# EAGLE schematic dev (EAGLE 4.16)
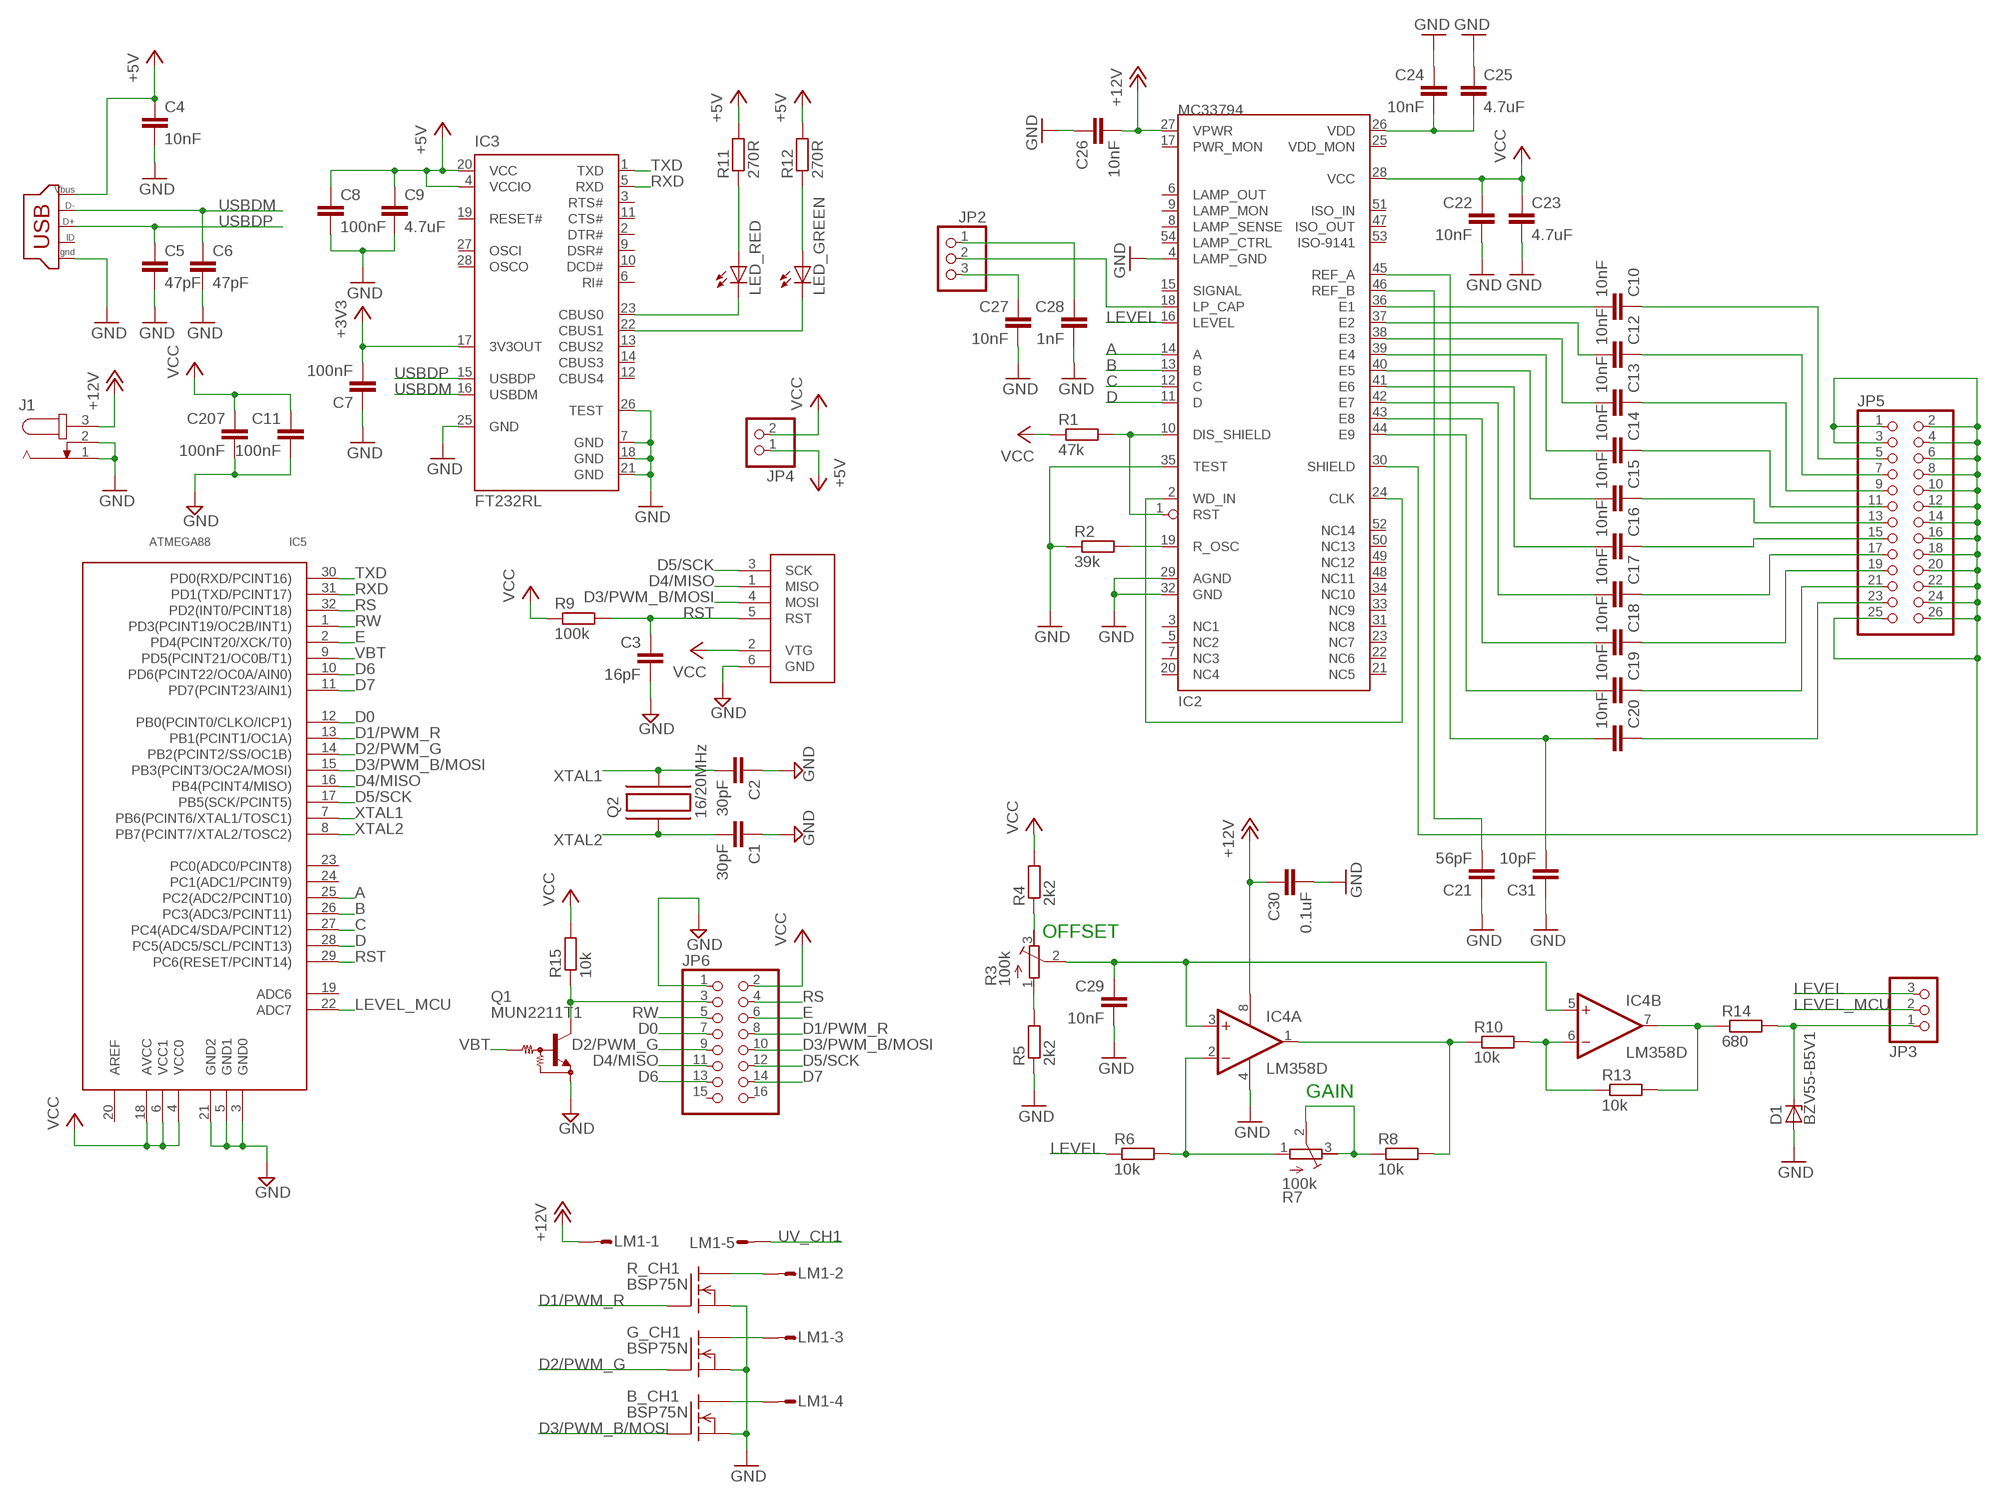
[diagram p0: schematic, sheet 1]

## Parts
B_CH1  BSP75N  [SOT223]
C1  30pF  C-EUC0603  [C0603]
C2  30pF  C-EUC0603  [C0603]
C3  16pF  C-EUC0603  [C0603]
C4  10nF  C-EUC0603  [C0603]
C5  47pF  C-EUC0603  [C0603]
C6  47pF  C-EUC0603  [C0603]
C7  100nF  C-EUC0603  [C0603]
C8  100nF  C-EUC0603  [C0603]
C9  4.7uF  C-EUC1206  [C1206]
C10  10nF  C-EUC0603  [C0603]
C11  100nF  C-EUC0603  [C0603]
C12  10nF  C-EUC0603  [C0603]
C13  10nF  C-EUC0603  [C0603]
C14  10nF  C-EUC0603  [C0603]
C15  10nF  C-EUC0603  [C0603]
C16  10nF  C-EUC0603  [C0603]
C17  10nF  C-EUC0603  [C0603]
C18  10nF  C-EUC0603  [C0603]
C19  10nF  C-EUC0603  [C0603]
C20  10nF  C-EUC0603  [C0603]
C21  56pF  C-EUC0603  [C0603]
C22  10nF  C-EUC0603  [C0603]
C23  4.7uF  C-EUC1206  [C1206]
C24  10nF  C-EUC0603  [C0603]
C25  4.7uF  C-EUC1206  [C1206]
C26  10nF  C-EUC0603  [C0603]
C27  10nF  C-EUC0603  [C0603]
C28  1nF  C-EUC0603  [C0603]
C29  10nF  C-EUC0603  [C0603]
C30  0.1uF  C-EUC0603  [C0603]
C31  10pF  C-EUC0603  [C0603]
C207  100nF  C-EUC0603  [C0603]
D1  BZV55-B5V1  ZENER-DIODESOD80C  [SOD80C]
G_CH1  BSP75N  [SOT223]
IC2  MC33794  [SOICW54]
IC3  FT232RL  [SSOP28]
IC4  LM358D  [SO08]
IC5  ATMEGA88  [TQFP32]
J1  JACK-PLUG1  [SPC4078]
JP2  PINHD-1X3  [1X03]
JP3  PINHD-1X3  [1X03]
JP4  PINHD-1X2  [1X02]
JP5  PINHD-2X13  [2X13]
JP6  PINHD-2X8  [2X08]
LED_GREEN  LEDCHIPLED_0603  [CHIPLED_0603]
LED_RED  LEDCHIPLED_0603  [CHIPLED_0603]
LM1  M05S  [05P]
Q1  MUN2211T1  [SC59-BEC]
Q2  16/20MHz  C-MAC-LFA147E  [SMD]
R1  47k  R-EU_R0603  [R0603@1]
R2  39k  R-EU_R0603  [R0603@1]
R3  100k  R-TRIMM3214W  [RTRIM3214W]
R4  2k2  R-EU_R0603  [R0603@1]
R5  2k2  R-EU_R0603  [R0603@1]
R6  10k  R-EU_R0603  [R0603@1]
R7  100k  R-TRIMM3214W  [RTRIM3214W]
R8  10k  R-EU_R0603  [R0603@1]
R9  100k  R-EU_R0603  [R0603@1]
R10  10k  R-EU_R0603  [R0603@1]
R11  270R  R-EU_R0603  [R0603@1]
R12  270R  R-EU_R0603  [R0603@1]
R13  10k  R-EU_R0603  [R0603@1]
R14  680  R-EU_R0603  [R0603@1]
R15  10k  R-EU_R0603  [R0603@1]
R_CH1  BSP75N  [SOT223]
U$8  USB_MINI_B  [USB_MINI_B]
X2  ISP  AVRISP6PIN  [6PIN]

## Nets
+3V3: C7.2 IC3.17(3V3OUT)
+5V: C4.1 C8.1 C9.1 IC3.4(VCCIO) IC3.20(VCC) JP4.1 R11.2 R12.2 U$8.P$1
+12V: C26.2 C30.1 IC2.27(VPWR) IC4.8(P:V+) J1.3 LM1.1
A: IC2.14(A) IC5.25(PC2(ADC2/PCINT10))
B: IC2.13(B) IC5.26(PC3(ADC3/PCINT11))
C: IC2.12(C) IC5.27(PC4(ADC4/SDA/PCINT12))
D: IC2.11(D) IC5.28(PC5(ADC5/SCL/PCINT13))
D0: IC5.12(PB0(PCINT0/CLKO/ICP1)) JP6.7
D1/PWM_R: IC5.13(PB1(PCINT1/OC1A)) JP6.8 R_CH1.1(IN)
D2/PWM_G: G_CH1.1(IN) IC5.14(PB2(PCINT2/SS/OC1B)) JP6.9
D3/PWM_B/MOSI: B_CH1.1(IN) IC5.15(PB3(PCINT3/OC2A/MOSI)) JP6.10 X2.4(MOSI)
D4/MISO: IC5.16(PB4(PCINT4/MISO)) JP6.11 X2.1(MISO)
D5/SCK: IC5.17(PB5(SCK/PCINT5)) JP6.12 X2.3(SCK)
D6: IC5.10(PD6(PCINT22/OC0A/AIN0)) JP6.13
D7: IC5.11(PD7(PCINT23/AIN1)) JP6.14
E: IC5.2(PD4(PCINT20/XCK/T0)) JP6.6
GND: B_CH1.3(SOURCE) C1.1 C2.1 C3.2 C4.2 C5.2 C6.2 C7.1 C8.2 C9.2 C11.2 C21.1 C22.2 C23.2 C24.1 C25.1 C26.1 C27.2 C28.2 C29.2 C30.2 C31.1 C207.2 D1.A G_CH1.3(SOURCE) IC2.4(LAMP_GND) IC2.29(AGND) IC2.32(GND) IC2.35(TEST) IC3.7(GND) IC3.18(GND) IC3.21(GND) IC3.25(GND) IC3.26(TEST) IC4.4(P:V-) IC5.3(GND0) IC5.5(GND1) IC5.21(GND2) J1.1 J1.2 JP6.1 Q1.E R2.1 R5.1 R_CH1.3(SOURCE) U$8.P$5 X2.6(GND)
LEVEL: IC2.16(LEVEL) JP3.3 R6.1
LEVEL_AMP: D1.C JP3.1 R14.2
LEVEL_MCU: IC5.22(ADC7) JP3.2
N$1: JP6.3 Q1.C R15.1
N$3: C10.2 IC2.36(E1)
N$4: C12.2 IC2.37(E2)
N$5: C13.2 IC2.38(E3)
N$6: LM1.2 R_CH1.2(DRAIN)
N$7: G_CH1.2(DRAIN) LM1.3
N$8: B_CH1.2(DRAIN) LM1.4
N$9: C14.2 IC2.39(E4)
N$10: IC3.22(CBUS1) LED_GREEN.C
N$11: LED_GREEN.A R12.1
N$12: LED_RED.A R11.1
N$13: IC3.23(CBUS0) LED_RED.C
N$14: C15.2 IC2.40(E5)
N$15: C16.2 IC2.41(E6)
N$16: C17.2 IC2.42(E7)
N$17: C18.2 IC2.43(E8)
N$18: C19.2 IC2.44(E9)
N$19: C20.2 C31.2 IC2.45(REF_A)
N$20: C21.2 IC2.46(REF_B)
N$21: IC2.2(WD_IN) IC2.24(CLK)
N$22: IC2.19(R_OSC) R2.2
N$23: C10.1 JP5.5
N$24: IC2.1(RST) IC2.10(DIS_SHIELD) R1.2
N$25: C24.2 C25.2 IC2.26(VDD)
N$26: C28.1 JP2.1
N$27: C27.1 JP2.3
N$28: IC2.18(LP_CAP) JP2.2
N$30: R7.2(S) R7.3(A) R8.1
N$31: R3.1(E) R5.2
N$32: R3.3(A) R4.1
N$33: C29.1 IC4.3(A:+IN) IC4.5(B:+IN) R3.2(S)
N$34: IC4.2(A:-IN) R6.2 R7.1(E)
N$35: IC4.1(A:OUT) R8.2 R10.1
N$36: C12.1 JP5.7
N$37: IC4.6(B:-IN) R10.2 R13.1
N$38: IC4.7(B:OUT) R13.2 R14.1
N$39: C13.1 JP5.9
N$40: C14.1 JP5.11
N$41: C15.1 JP5.13
N$42: C16.1 JP5.15
N$43: C17.1 JP5.17
N$44: C18.1 JP5.19
N$45: C19.1 JP5.21
N$46: C20.1 JP5.23
N$47: IC2.30(SHIELD) JP5.1 JP5.2 JP5.3 JP5.4 JP5.6 JP5.8 JP5.10 JP5.12 JP5.14 JP5.16 JP5.18 JP5.20 JP5.22 JP5.24 JP5.25 JP5.26
RS: IC5.32(PD2(INT0/PCINT18)) JP6.4
RST: C3.1 IC5.29(PC6(RESET/PCINT14)) R9.2 X2.5(RST)
RW: IC5.1(PD3(PCINT19/OC2B/INT1)) JP6.5
RXD: IC3.5(RXD) IC5.31(PD1(TXD/PCINT17))
TXD: IC3.1(TXD) IC5.30(PD0(RXD/PCINT16))
USBDM: C6.1 IC3.16(USBDM) U$8.P$2
USBDP: C5.1 IC3.15(USBDP) U$8.P$3
UV_CH1: LM1.5
VBT: IC5.9(PD5(PCINT21/OC0B/T1)) Q1.B
VCC: C11.1 C22.1 C23.1 C207.1 IC2.28(VCC) IC5.4(VCC0) IC5.6(VCC1) IC5.18(AVCC) JP4.2 JP6.2 R1.1 R4.2 R9.1 R15.2 X2.2(VTG)
XTAL1: C2.2 IC5.7(PB6(PCINT6/XTAL1/TOSC1)) Q2.P$2
XTAL2: C1.2 IC5.8(PB7(PCINT7/XTAL2/TOSC2)) Q2.P$1
Unconnected: B_CH1.4(SOURCE_TAB) G_CH1.4(SOURCE_TAB) IC2.3(NC1) IC2.5(NC2) IC2.6(LAMP_OUT) IC2.7(NC3) IC2.8(LAMP_SENSE) IC2.9(LAMP_MON) IC2.15(SIGNAL) IC2.17(PWR_MON) IC2.20(NC4) IC2.21(NC5) IC2.22(NC6) IC2.23(NC7) IC2.25(VDD_MON) IC2.31(NC8) IC2.33(NC9) IC2.34(NC10) IC2.47(ISO_OUT) IC2.48(NC11) IC2.49(NC12) IC2.50(NC13) IC2.51(ISO_IN) IC2.52(NC14) IC2.53(ISO-9141) IC2.54(LAMP_CTRL) IC3.2(DTR#) IC3.3(RTS#) IC3.6(RI#) IC3.9(DSR#) IC3.10(DCD#) IC3.11(CTS#) IC3.12(CBUS4) IC3.13(CBUS2) IC3.14(CBUS3) IC3.19(RESET#) IC3.27(OSCI) IC3.28(OSCO) IC5.19(ADC6) IC5.20(AREF) IC5.23(PC0(ADC0/PCINT8)) IC5.24(PC1(ADC1/PCINT9)) JP6.15 JP6.16 R_CH1.4(SOURCE_TAB) U$8.P$4

## Notes on the sheet
- TX | RX
- 50mA
- OFFSET
- GAIN

## Library data of the parts
B_CH1 G_CH1 R_CH1 = my-library:BSP75N
C1-C31 C207 = rcl:C-EU: CAPACITOR, European symbol
D1 = diode:ZENER-DIODE: Z-Diode
IC2 = mc33794:MC33794
IC3 = ftdichip:FT232R: Source: http://www.ftdichip.com/Documents/DataSheets/DS_FT232R_v104.pdf
IC4 = linear:LM358: OP AMP also LM158; LM258; LM2904 Source: http://cache.national.com/ds/LM/LM158.pdf
IC5 = atmega88:ATMEGA88
J1 = con-jack:JACK-PLUG: DC POWER JACK Power Jack, DC, Right Angle, Through Hole, Rated 5A at 16VDC, PC Terminals Distributor: Farnell (www.Farnell.de) Drawing: 84N1161.pdf / 84N1162.pdf Manufacturer: SPC Technology (www.spctechnology.com) Type: SPC4077 / SPC 4078
JP2 JP3 = pinhead:PINHD-1X3: PIN HEADER
JP4 = pinhead:PINHD-1X2: PIN HEADER
JP5 = pinhead:PINHD-2X13: PIN HEADER
JP6 = pinhead:PINHD-2X8: PIN HEADER
LED_GREEN LED_RED = led:LED: LED OSRAM: - CHIPLED LG R971, LG N971, LY N971, LG Q971, LY Q971, LO R971, LY R971 LH N974, LH R974 LS Q976, LO Q976, LY Q976 LO Q996 - Hyper CHIPLED LW Q18S LB Q993, LB Q99A, LB R99A - SideLED LS A670, LO A670, LY A670, LG A670, LP A670 LB A673, LV A673, LT A673, LW A673 LH A674 LY A675 LS A676, LA A676, LO A676, LY A676, LW A676 LS A679, LY A679, LG A679 - Hyper Micro SIDELED® LS Y876, LA Y876, LO Y876, LY Y876 LT Y87S - SmartLED LW L88C, LW L88S LB L89C, LB L89S, LG L890 LS L89K, LO L89K, LY L89K LS L896, LA L896, LO L896, LY L896 - TOPLED LS T670, LO T670, LY T670, LG T670, LP T670 LSG T670, LSP T670, LSY T670, LOP T670, LYG T670 LG T671, LOG T671, LSG T671 LB T673, LV T673, LT T673, LW T673 LH T674 LS T676, LA T676, LO T676, LY T676, LB T676, LH T676, LSB T676, LW T676 LB T67C, LV T67C, LT T67C, LS T67K, LO T67K, LY T67K, LW E67C LS E67B, LA E67B, LO E67B, LY E67B, LB E67C, LV E67C, LT E67C LW T67C LS T679, LY T679, LG T679 LS T770, LO T770, LY T770, LG T770, LP T770 LB T773, LV T773, LT T773, LW T773 LH T774 LS E675, LA E675, LY E675, LS T675 LS T776, LA T776, LO T776, LY T776, LB T776 LHGB T686 LT T68C, LB T68C - Hyper Mini TOPLED® LB M676 - Mini TOPLED Santana® LG M470 LS M47K, LO M47K, LY M47K Source: http://www.osram.convergy.de - LUMILED® LXK2-PW12-R00, LXK2-PW12-S00, LXK2-PW14-U00, LXK2-PW14-V00 LXK2-PM12-R00, LXK2-PM12-S00, LXK2-PM14-U00 LXK2-PE12-Q00, LXK2-PE12-R00, LXK2-PE12-S00, LXK2-PE14-T00, LXK2-PE14-U00 LXK2-PB12-K00, LXK2-PB12-L00, LXK2-PB12-M00, LXK2-PB14-N00, LXK2-PB14-P00, LXK2-PB14-Q00 LXK2-PR12-L00, LXK2-PR12-M00, LXK2-PR14-Q00, LXK2-PR14-R00 LXK2-PD12-Q00, LXK2-PD12-R00, LXK2-PD12-S00 LXK2-PH12-R00, LXK2-PH12-S00 LXK2-PL12-P00, LXK2-PL12-Q00, LXK2-PL12-R00 Source: www.luxeon.com
LM1 = con-amp-quick:M05S: AMP QUICK CONNECTOR
Q1 = transistor-npn:MUN2211*: NPN Bias Resistor Transistor
Q2 = hc49-4h-smx:C-MAC-LFA147E
R1 R2 R4-R6 R8-R15 = rcl:R-EU_: RESISTOR, European symbol
R3 R7 = rcl:R-TRIMM: Trimm resistor
U$8 = mgs:USB_MINI_B
X2 = avrisp:AVRISP6PIN